# Altium schematic sheet Sheet3.SchDoc
size 1473 x 381 mm
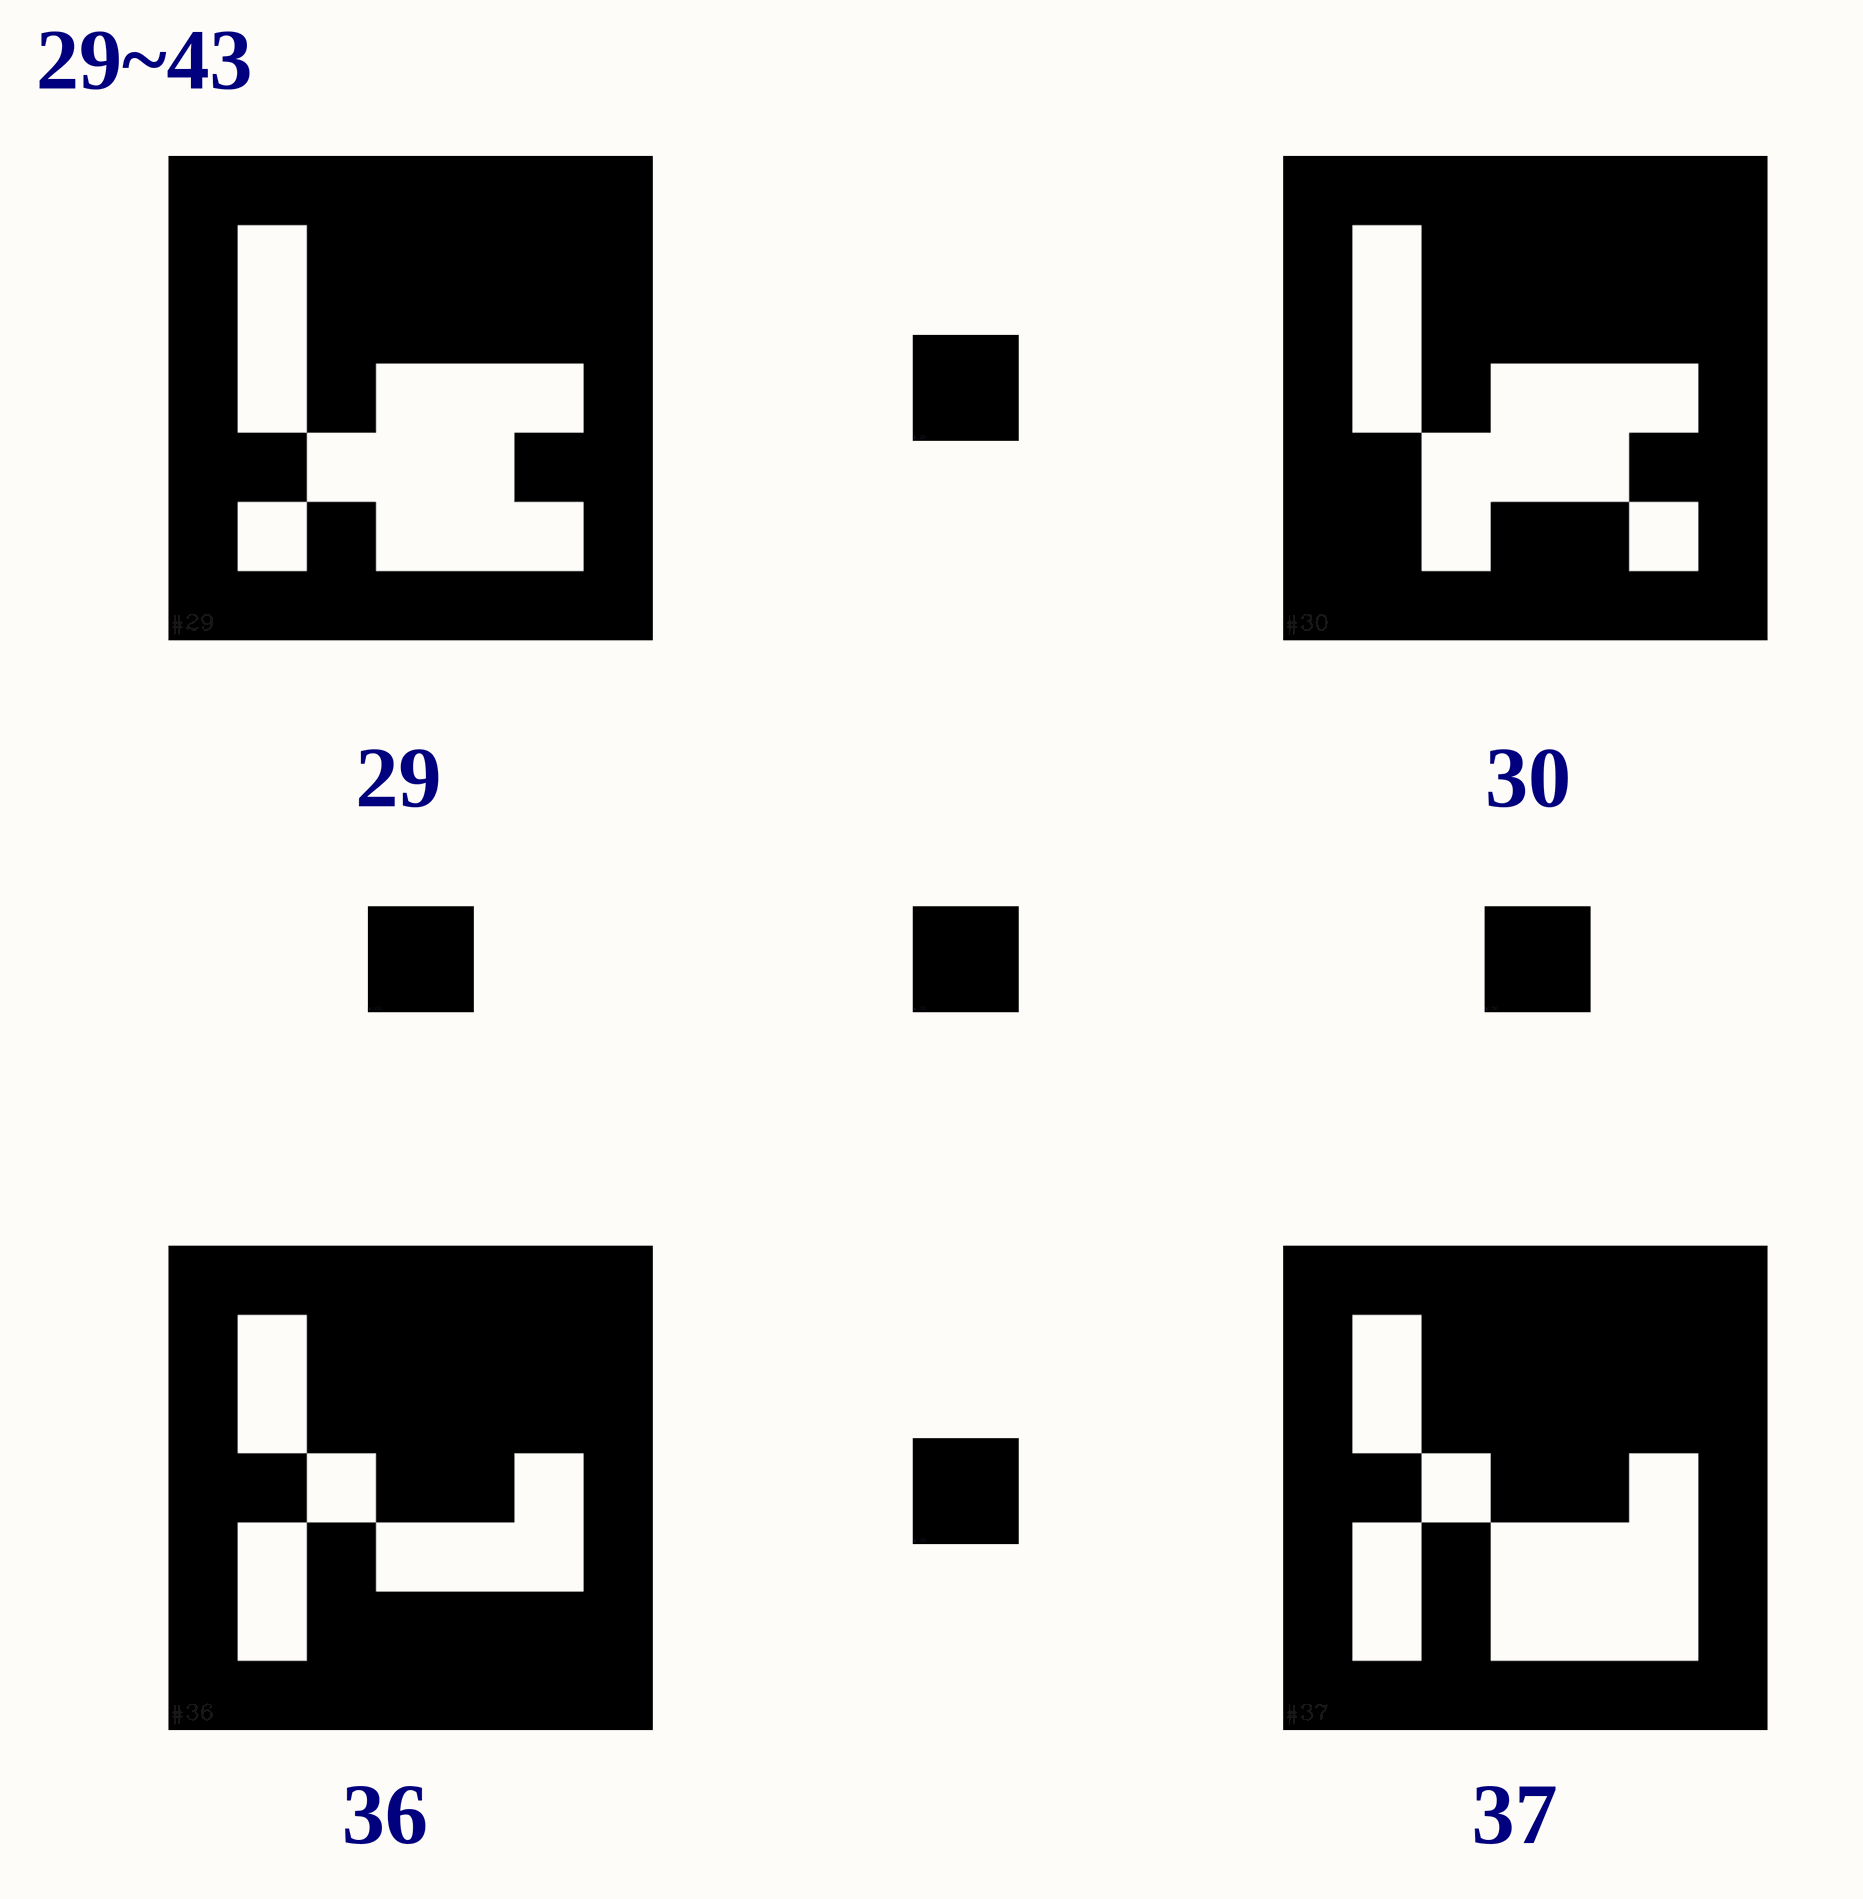
[diagram p0: Sheet3.SchDoc, column 1 of 4]
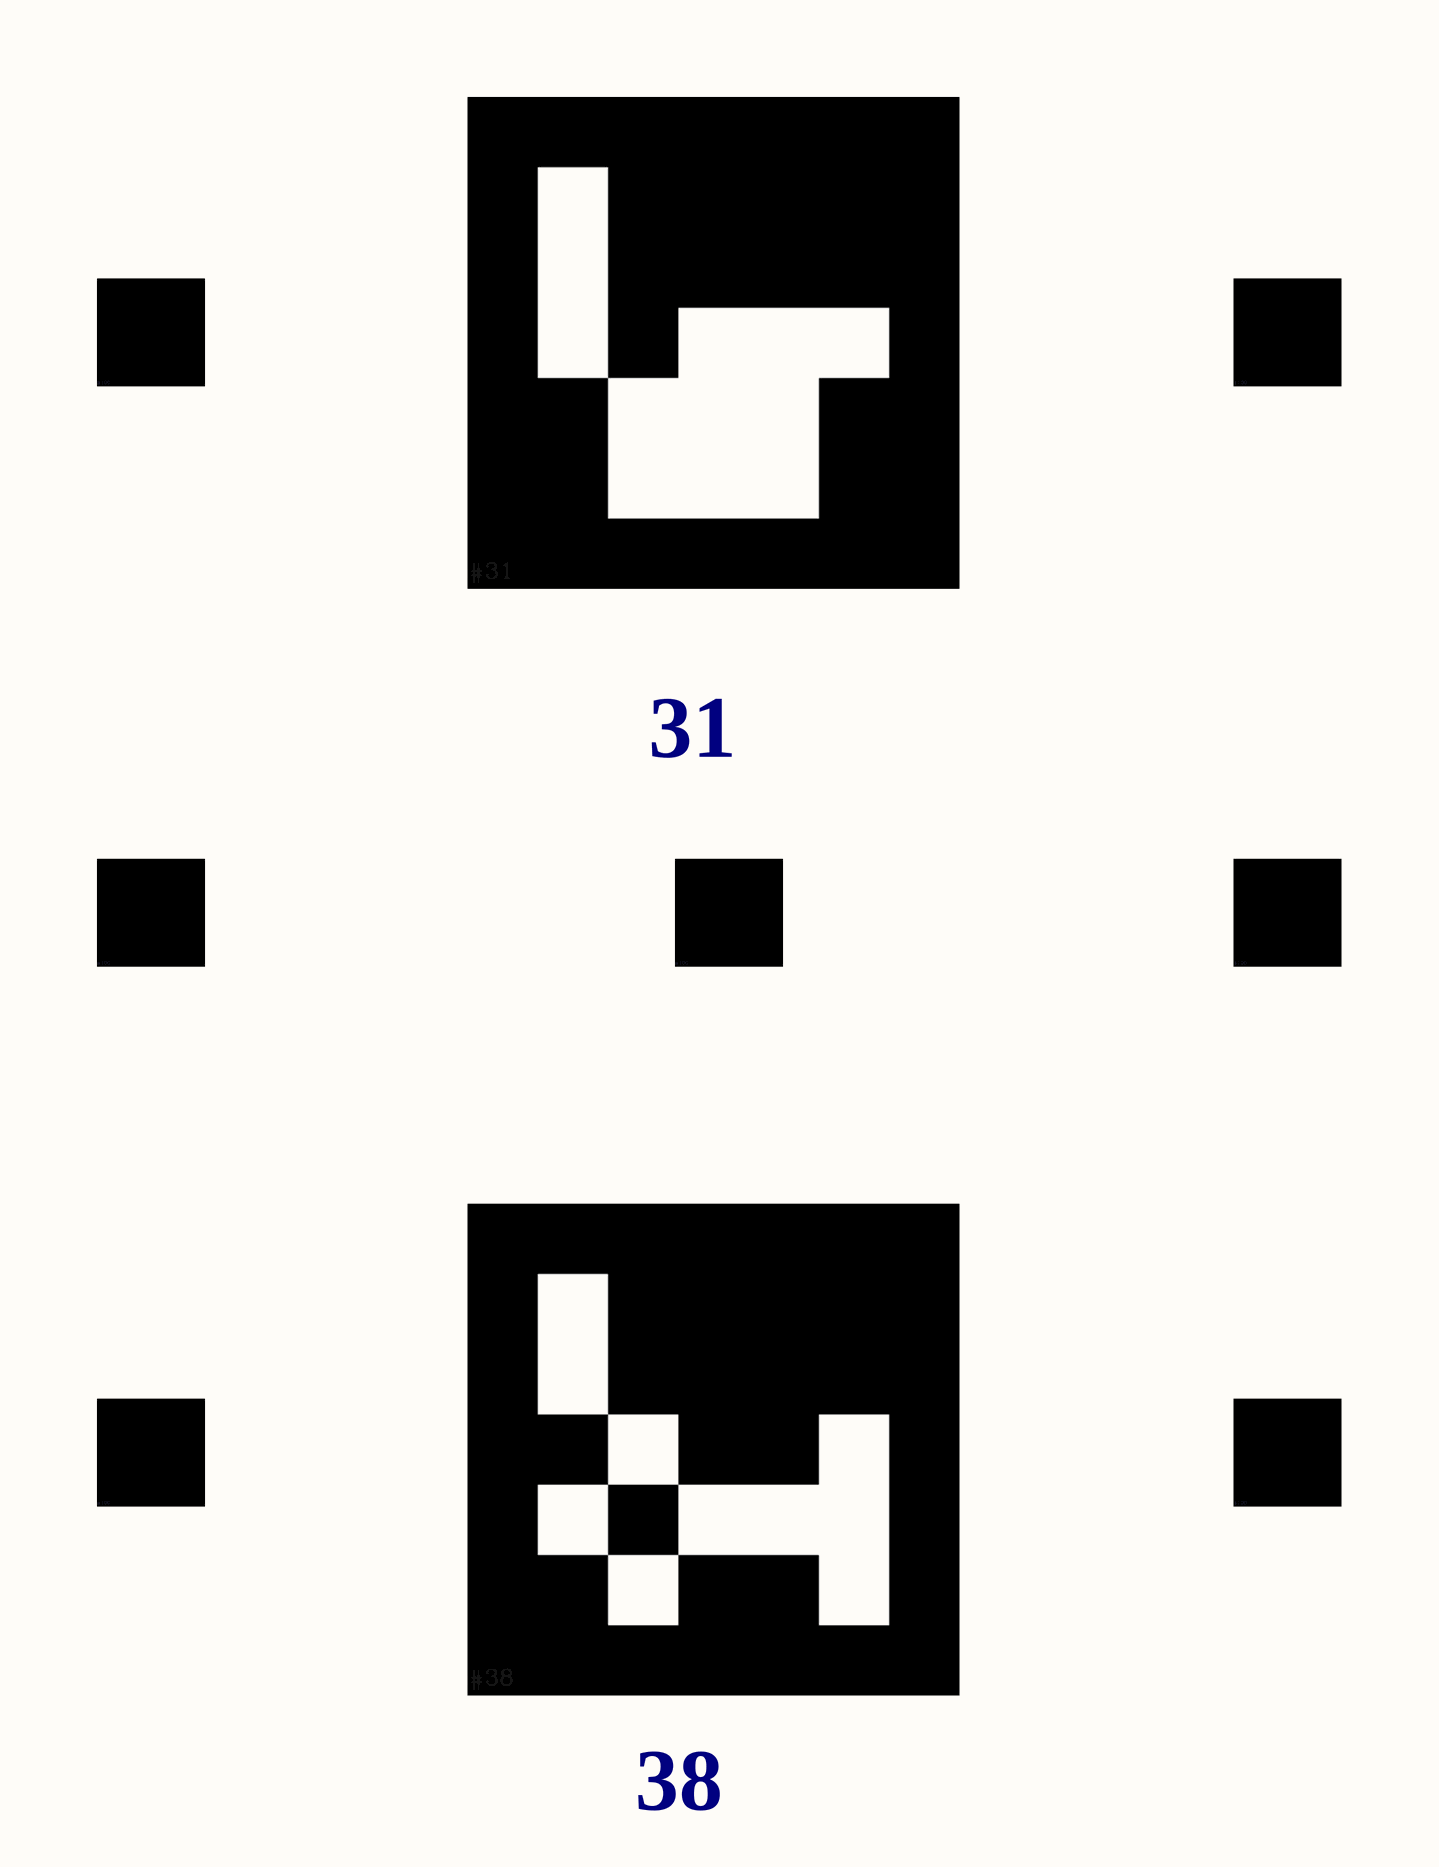
[diagram p1: Sheet3.SchDoc, column 2 of 4]
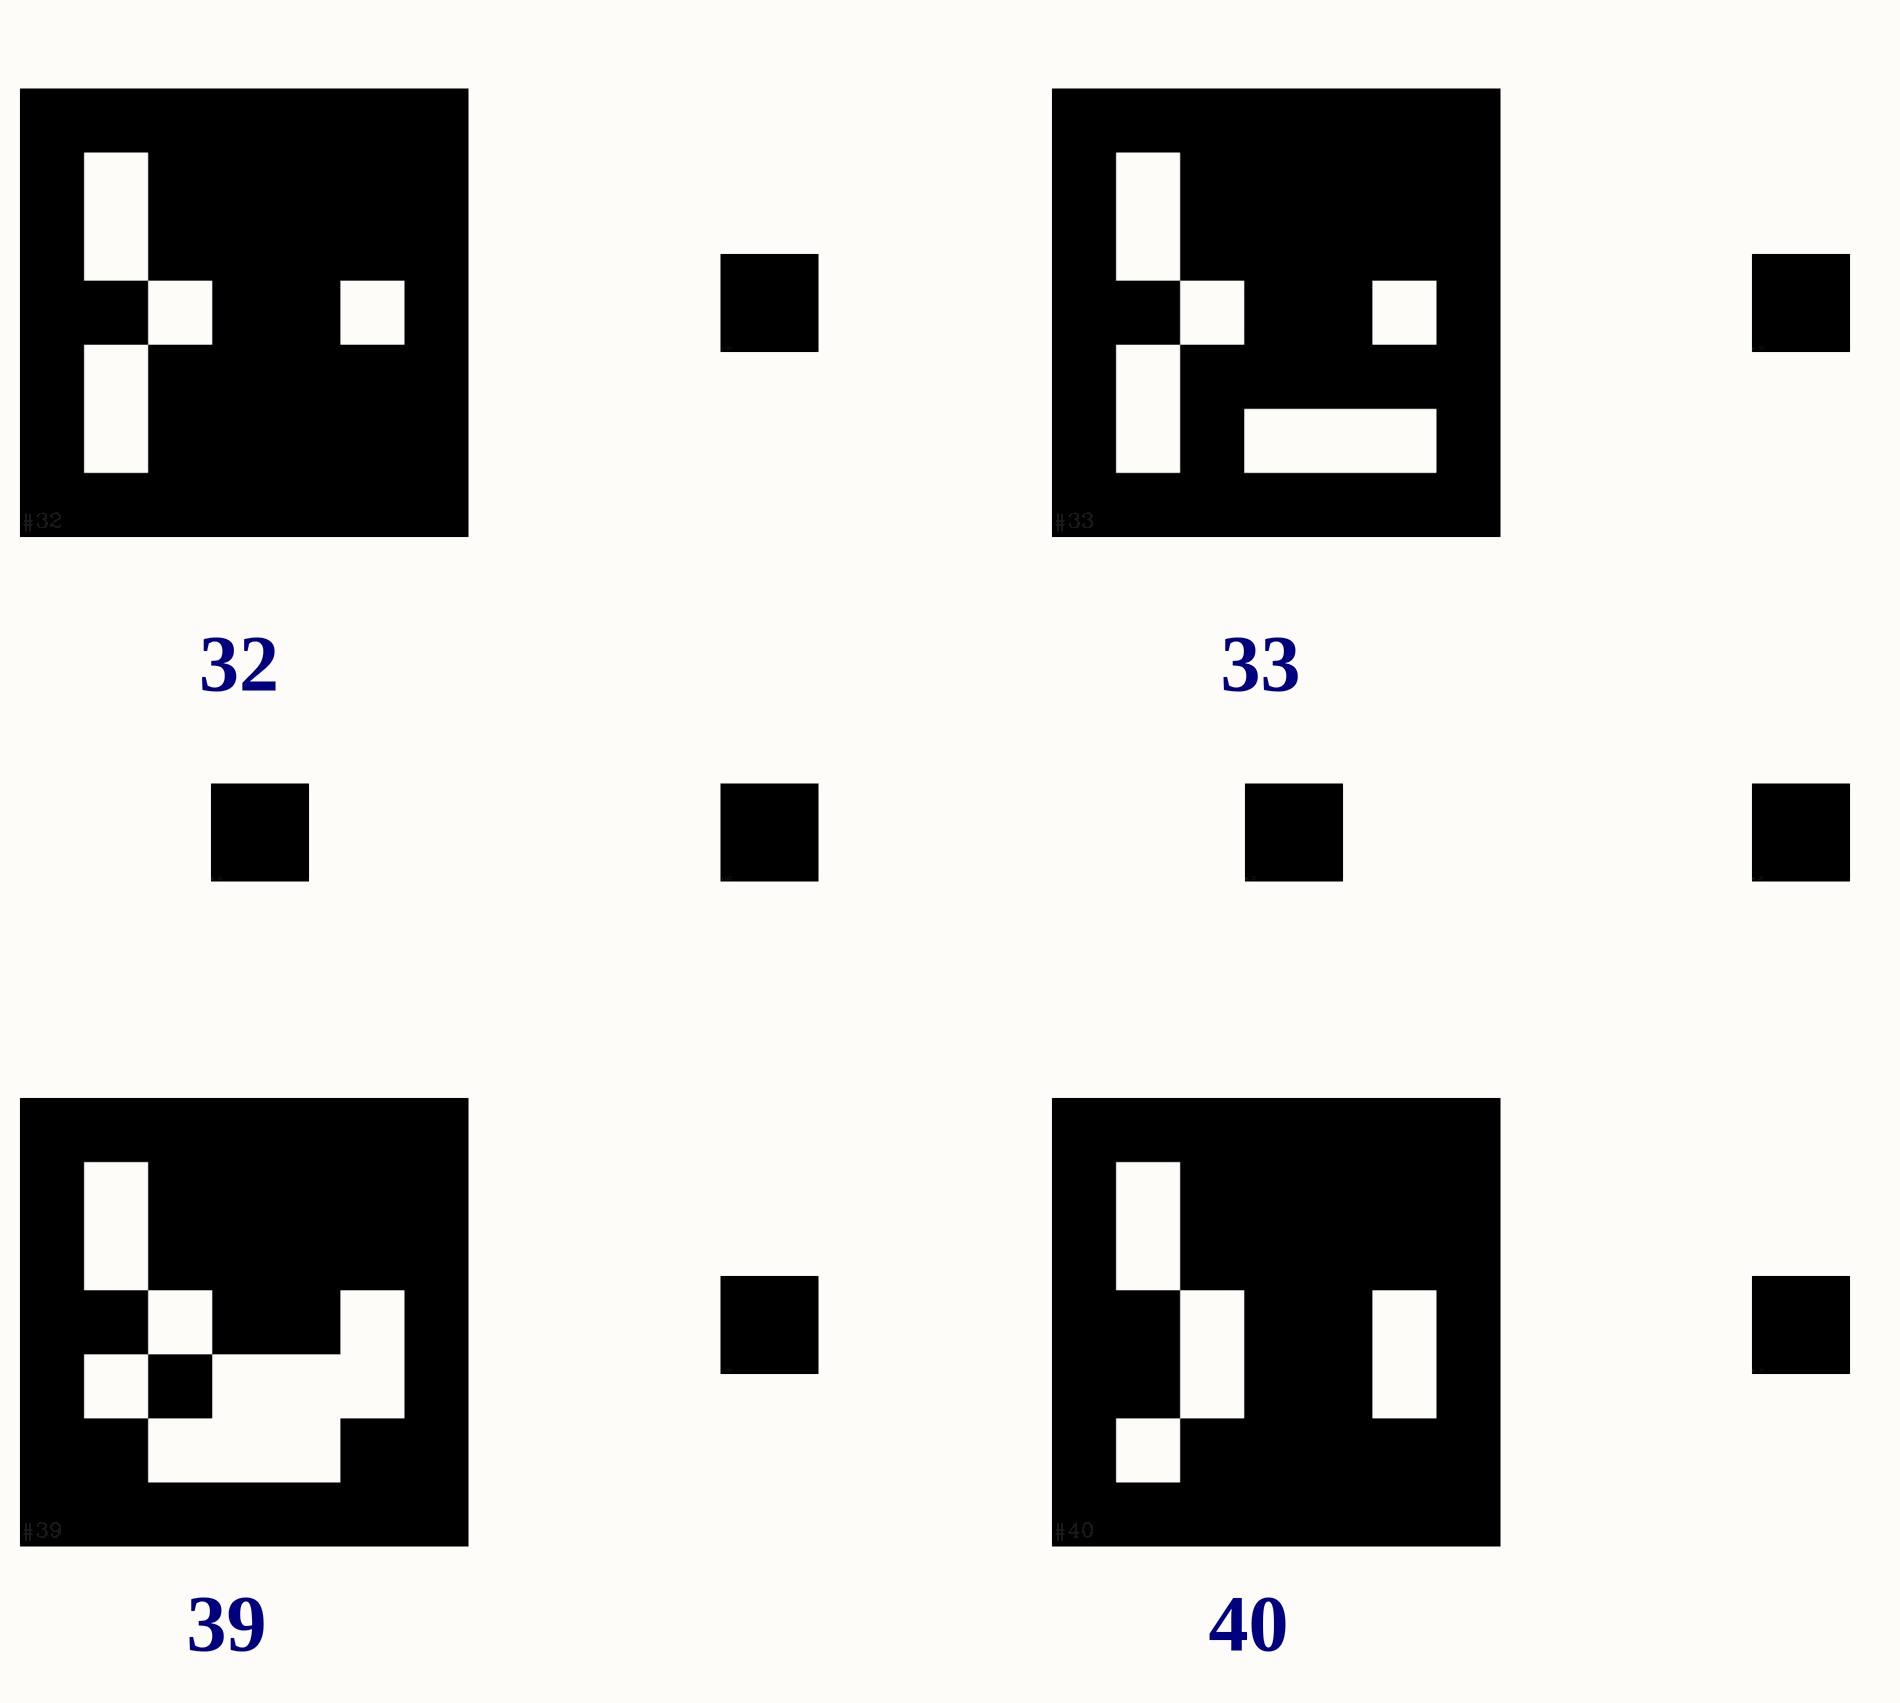
[diagram p2: Sheet3.SchDoc, column 3 of 4]
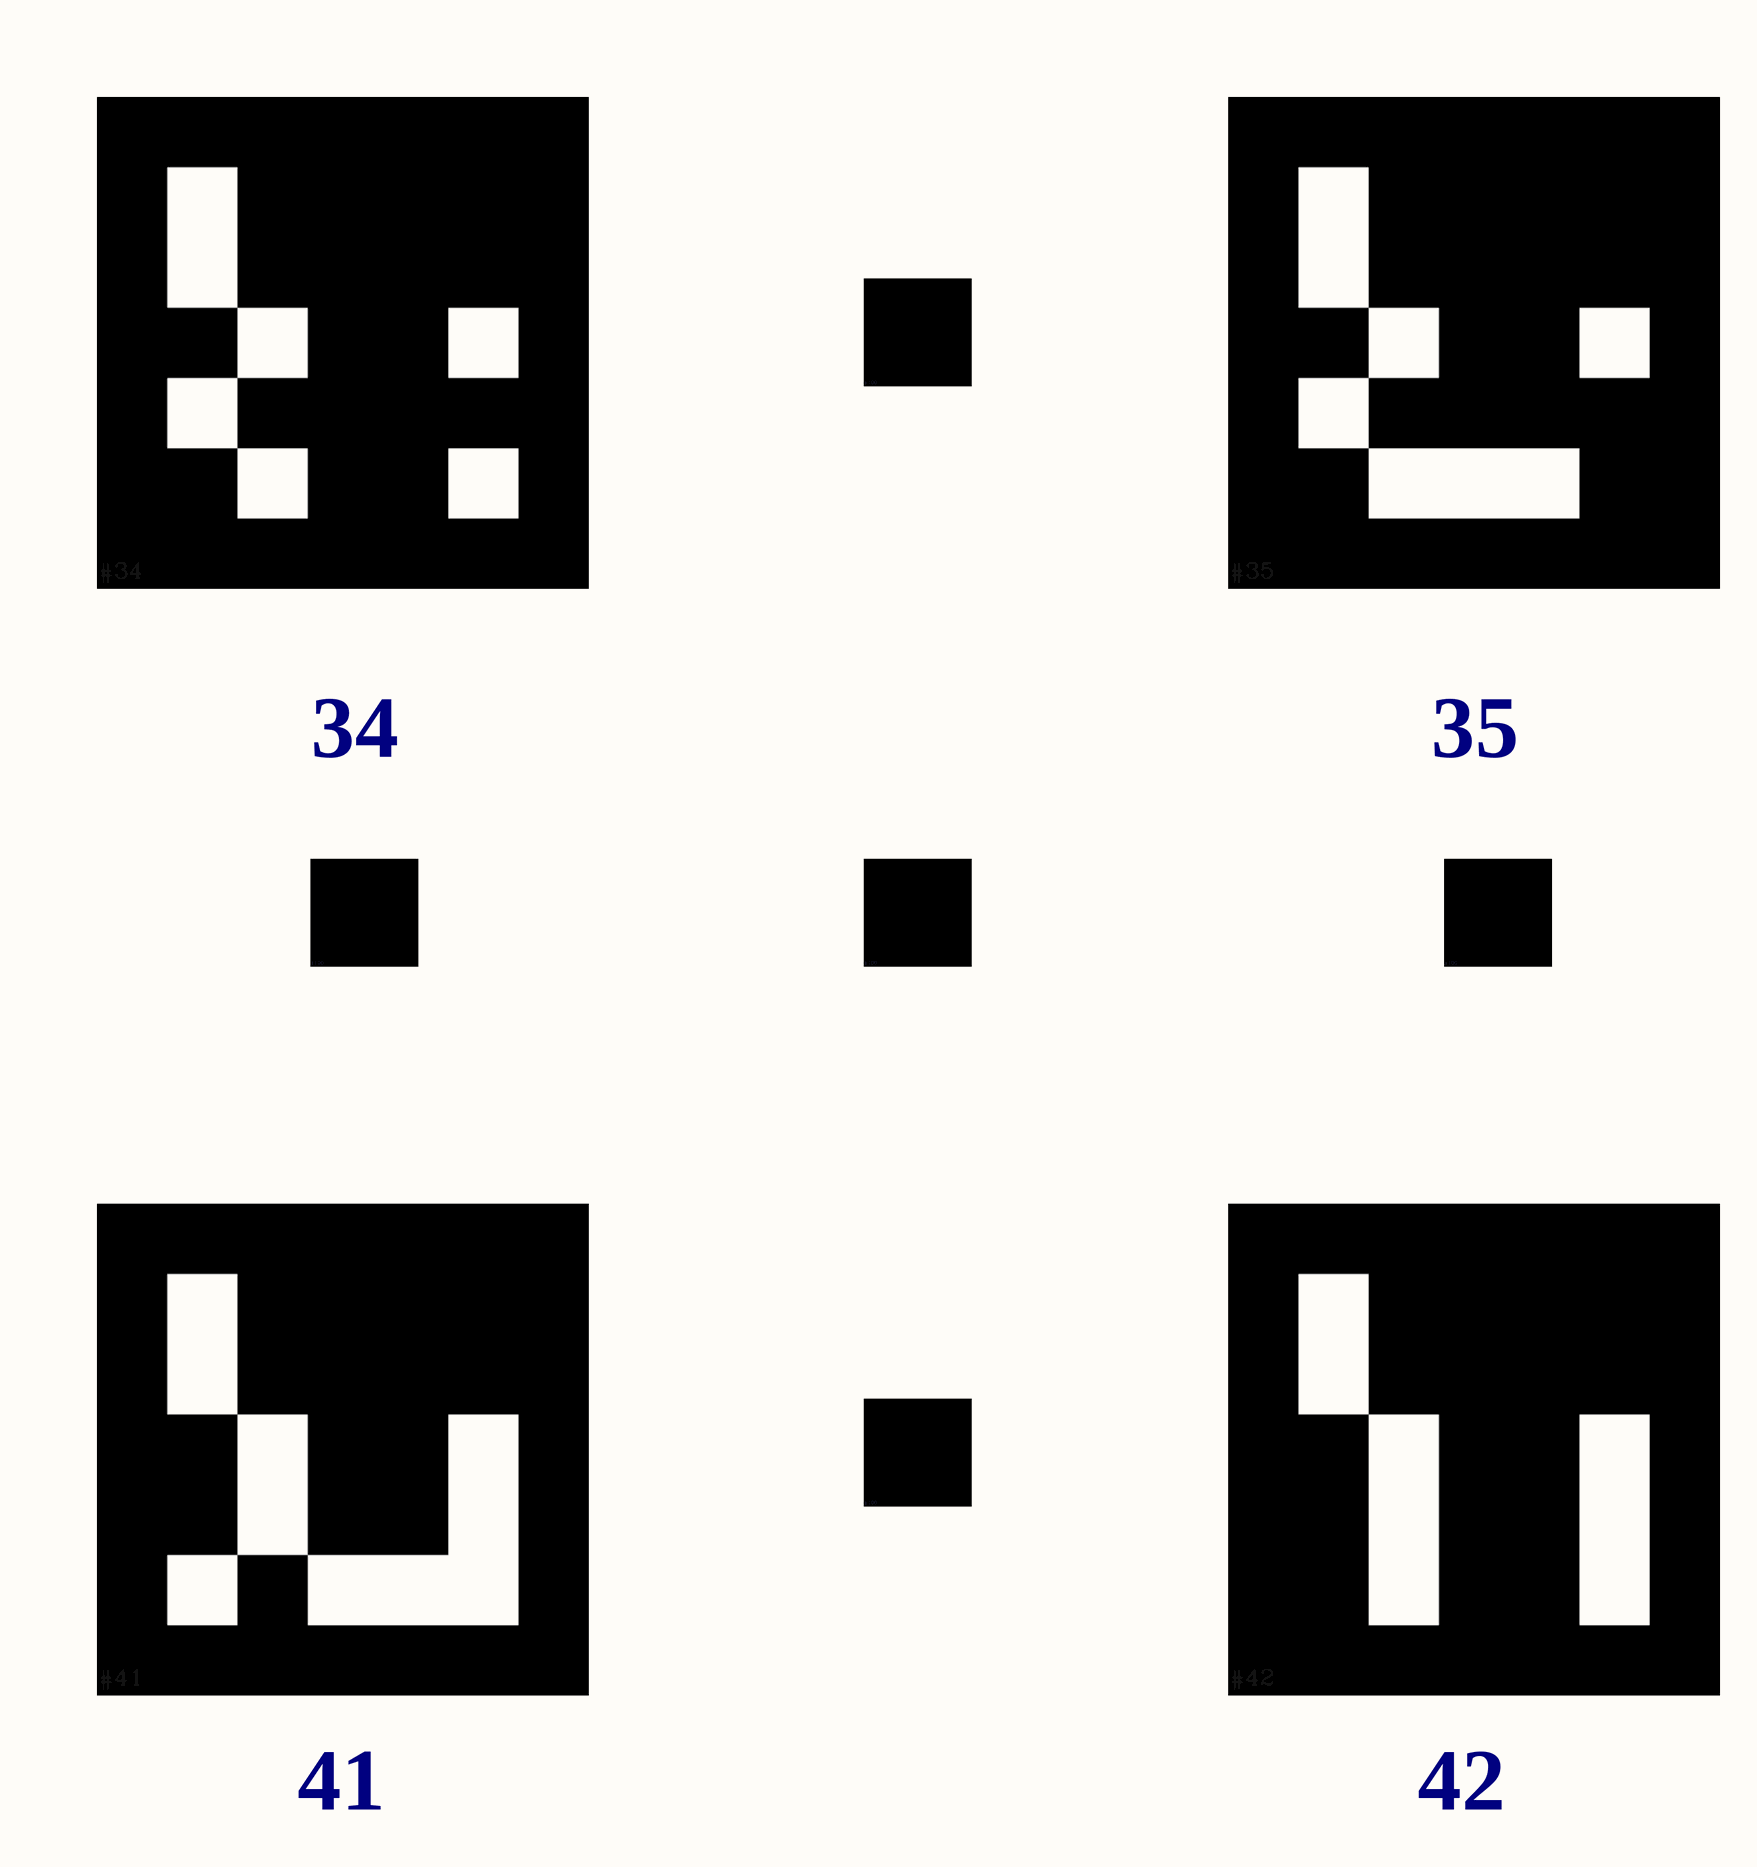
[diagram p3: Sheet3.SchDoc, column 4 of 4]

## Notes on the sheet
- 29~43
- 29
- 30
- 31
- 32
- 33
- 34
- 35
- 36
- 37
- 38
- 39
- 40
- 41
- 42